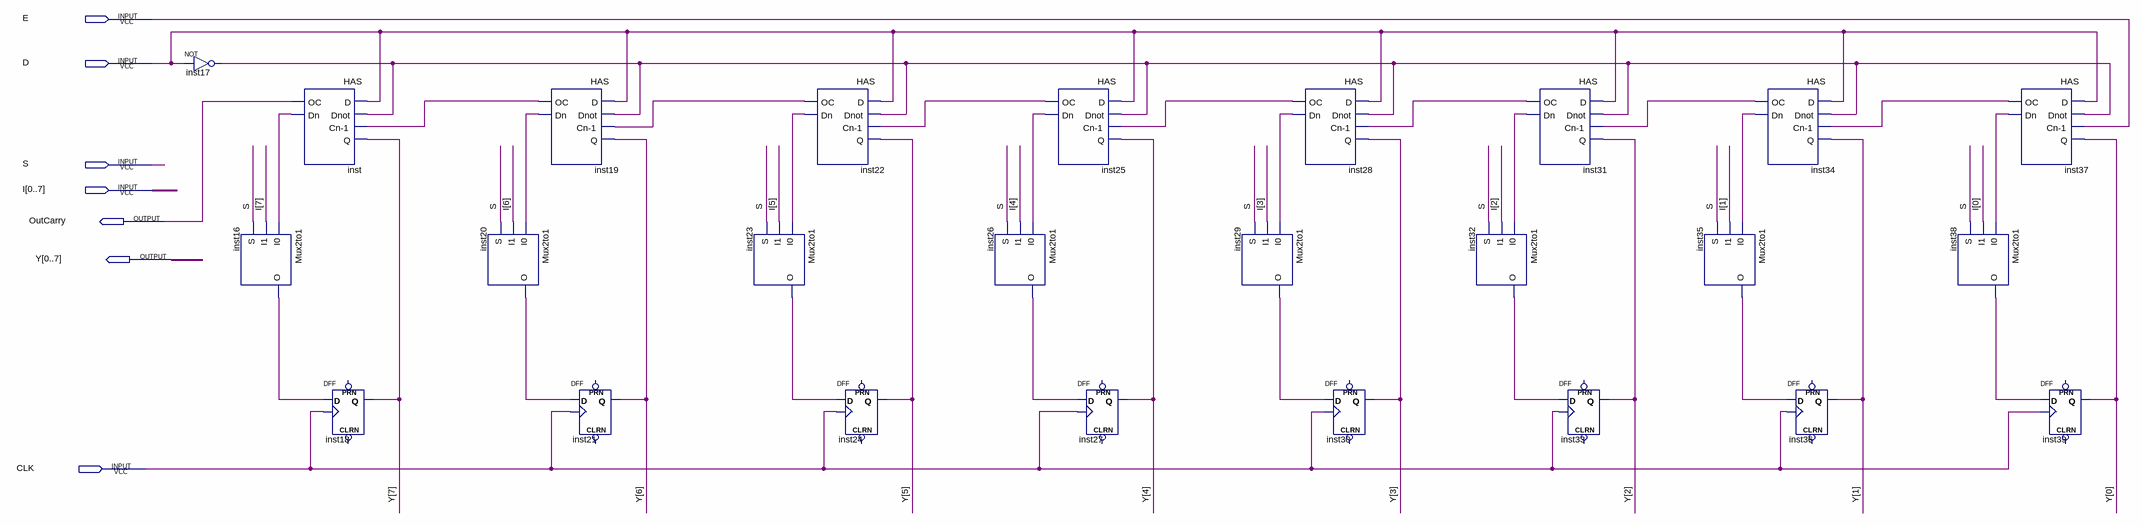
[diagram p0: schematic sheet]
// Quartus schematic regcounter.bdf as structural Verilog: 25 symbols, 7 pins
module regcounter (
  input  E,
  input  D,
  input  S,
  input  [0:7] I,
  input  CLK,
  output OutCarry,
  output [0:7] Y
);

  wire inst16_o, inst17_out, inst19_dn, inst19_oc, inst20_o, inst22_dn, inst22_oc, inst23_o, inst25_dn,
       inst25_oc, inst26_o, inst28_dn, inst28_oc, inst29_o, inst31_dn, inst31_oc, inst32_o, inst34_dn,
       inst34_oc, inst35_o, inst37_dn, inst37_oc, inst38_o, inst_dn;

  not inst17 (inst17_out, D);
  Mux2to1 inst16 (.I0(inst_dn), .I1(I[7]), .S(S), .O(inst16_o));
  HAS inst (.D(D), .Dnot(inst17_out), .\Cn-1 (inst19_oc), .Q(Y[7]), .OC(OutCarry), .Dn(inst_dn));
  DFF inst18 (.CLK(CLK), .D(inst16_o), .Q(Y[7]));  // open: CLRN, PRN
  Mux2to1 inst20 (.I0(inst19_dn), .I1(I[6]), .S(S), .O(inst20_o));
  HAS inst19 (.D(D), .Dnot(inst17_out), .\Cn-1 (inst22_oc), .Q(Y[6]), .OC(inst19_oc), .Dn(inst19_dn));
  DFF inst21 (.CLK(CLK), .D(inst20_o), .Q(Y[6]));  // open: CLRN, PRN
  Mux2to1 inst23 (.I0(inst22_dn), .I1(I[5]), .S(S), .O(inst23_o));
  HAS inst22 (.D(D), .Dnot(inst17_out), .\Cn-1 (inst25_oc), .Q(Y[5]), .OC(inst22_oc), .Dn(inst22_dn));
  DFF inst24 (.CLK(CLK), .D(inst23_o), .Q(Y[5]));  // open: CLRN, PRN
  Mux2to1 inst26 (.I0(inst25_dn), .I1(I[4]), .S(S), .O(inst26_o));
  HAS inst25 (.D(D), .Dnot(inst17_out), .\Cn-1 (inst28_oc), .Q(Y[4]), .OC(inst25_oc), .Dn(inst25_dn));
  DFF inst27 (.CLK(CLK), .D(inst26_o), .Q(Y[4]));  // open: CLRN, PRN
  Mux2to1 inst29 (.I0(inst28_dn), .I1(I[3]), .S(S), .O(inst29_o));
  HAS inst28 (.D(D), .Dnot(inst17_out), .\Cn-1 (inst31_oc), .Q(Y[3]), .OC(inst28_oc), .Dn(inst28_dn));
  DFF inst30 (.CLK(CLK), .D(inst29_o), .Q(Y[3]));  // open: CLRN, PRN
  Mux2to1 inst32 (.I0(inst31_dn), .I1(I[2]), .S(S), .O(inst32_o));
  HAS inst31 (.D(D), .Dnot(inst17_out), .\Cn-1 (inst34_oc), .Q(Y[2]), .OC(inst31_oc), .Dn(inst31_dn));
  DFF inst33 (.CLK(CLK), .D(inst32_o), .Q(Y[2]));  // open: CLRN, PRN
  Mux2to1 inst35 (.I0(inst34_dn), .I1(I[1]), .S(S), .O(inst35_o));
  HAS inst34 (.D(D), .Dnot(inst17_out), .\Cn-1 (inst37_oc), .Q(Y[1]), .OC(inst34_oc), .Dn(inst34_dn));
  DFF inst36 (.CLK(CLK), .D(inst35_o), .Q(Y[1]));  // open: CLRN, PRN
  Mux2to1 inst38 (.I0(inst37_dn), .I1(I[0]), .S(S), .O(inst38_o));
  HAS inst37 (.D(D), .Dnot(inst17_out), .\Cn-1 (E), .Q(Y[0]), .OC(inst37_oc), .Dn(inst37_dn));
  DFF inst39 (.CLK(CLK), .D(inst38_o), .Q(Y[0]));  // open: CLRN, PRN
endmodule
